# Altium project syspcb.PrjPCB
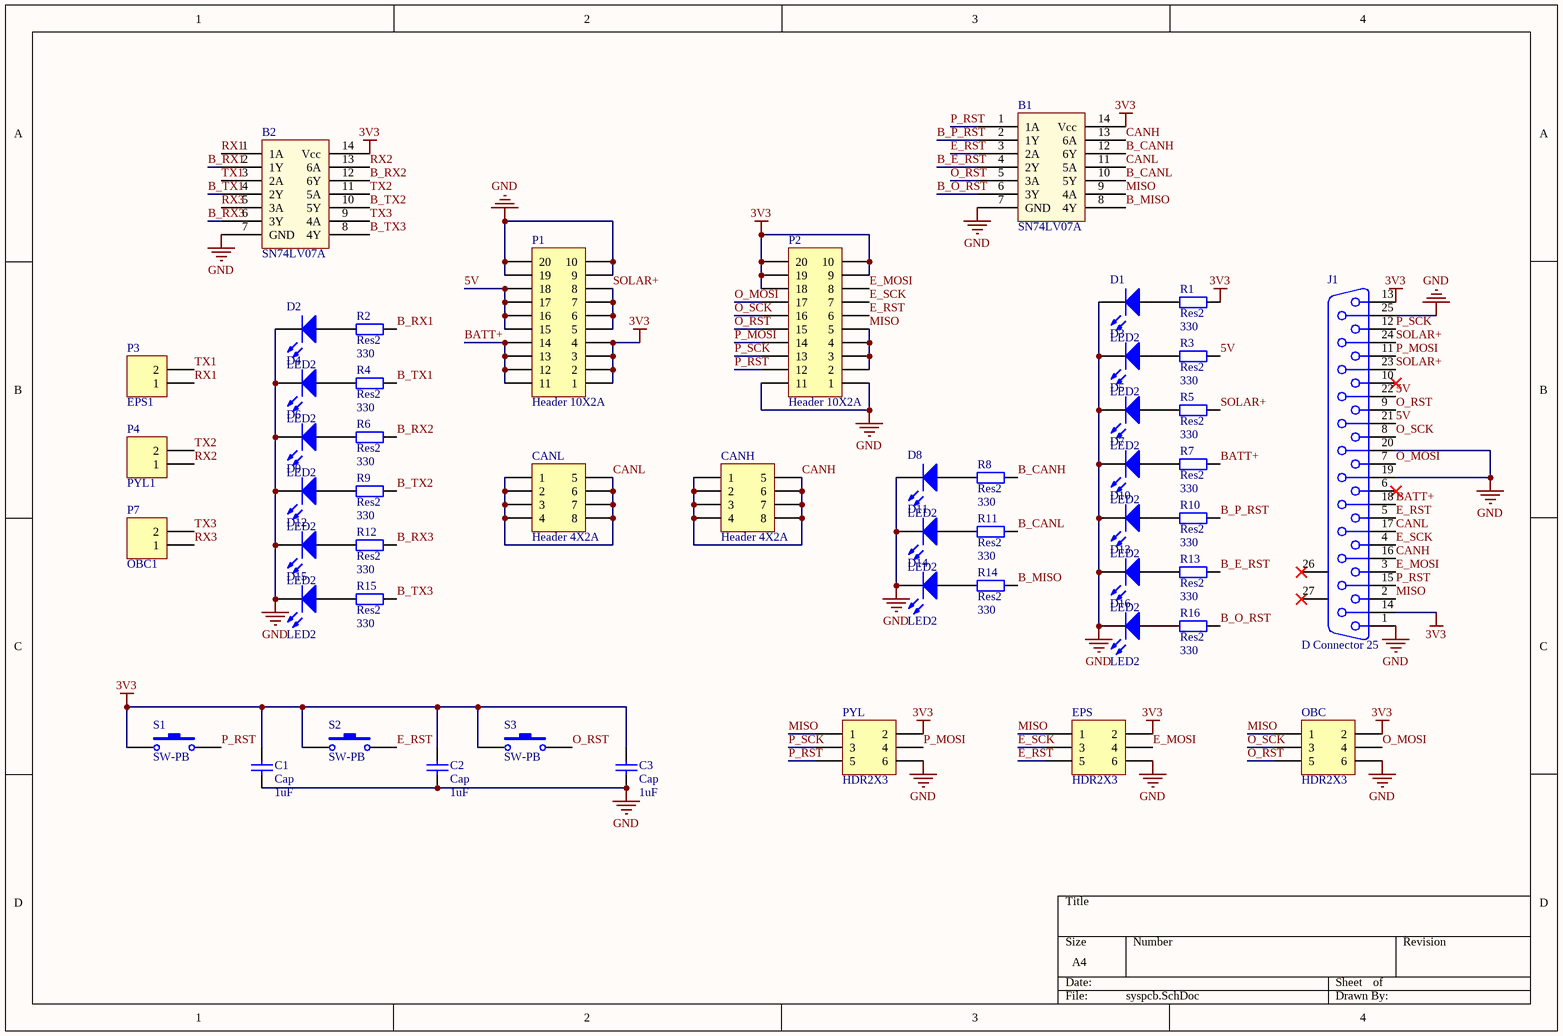
[diagram p0: syspcb.SchDoc]
1 sheet, 51 parts. Net scope: global (net labels, ports and power ports of the same name join across sheets).
Board file: syspcb.PcbDoc

## Sheet syspcb.SchDoc
size A4

### Parts
B1  SN74LV07A  [SOIC127P600X175-14N]
B2  SN74LV07A  [SOIC127P600X175-14N]
C1  Cap  value 1uF  [1608[0603]]
C2  Cap  value 1uF  [1608[0603]]
C3  Cap  value 1uF  [1608[0603]]
CANH  Header 4X2A  [HDR2X4_CEN]
CANL  Header 4X2A  [HDR2X4_CEN]
D1  LED2  [0603-LED]
D2  LED2  [0603-LED]
D3  LED2  [0603-LED]
D4  LED2  [0603-LED]
D5  LED2  [0603-LED]
D6  LED2  [0603-LED]
D7  LED2  [0603-LED]
D8  LED2  [0603-LED]
D9  LED2  [0603-LED]
D10  LED2  [0603-LED]
D11  LED2  [0603-LED]
D12  LED2  [0603-LED]
D13  LED2  [0603-LED]
D14  LED2  [0603-LED]
D15  LED2  [0603-LED]
D16  LED2  [0603-LED]
EPS  HDR2X3  [HDR2X3]
J1  D Connector 25  [DSUB1.385-2H25A]
OBC  HDR2X3  [HDR2X3]
P1  Header 10X2A  [HDR2X10_CEN]
P2  Header 10X2A  [HDR2X10_CEN]
P3  EPS1  [HDR1X2]
P4  PYL1  [HDR1X2]
P7  OBC1  [HDR1X2]
PYL  HDR2X3  [HDR2X3]
R1  Res2  value 330  [J1-0603]
R2  Res2  value 330  [J1-0603]
R3  Res2  value 330  [J1-0603]
R4  Res2  value 330  [J1-0603]
R5  Res2  value 330  [J1-0603]
R6  Res2  value 330  [J1-0603]
R7  Res2  value 330  [J1-0603]
R8  Res2  value 330  [J1-0603]
R9  Res2  value 330  [J1-0603]
R10  Res2  value 330  [J1-0603]
R11  Res2  value 330  [J1-0603]
R12  Res2  value 330  [J1-0603]
R13  Res2  value 330  [J1-0603]
R14  Res2  value 330  [J1-0603]
R15  Res2  value 330  [J1-0603]
R16  Res2  value 330  [J1-0603]
S1  SW-PB  [SW_5-1437565-0]
S2  SW-PB  [SW_5-1437565-0]
S3  SW-PB  [SW_5-1437565-0]

### Nets
3V3: B1.14(Vcc) B2.14(Vcc) C1.2 C2.2 C3.2 EPS.2 J1.13 J1.14 OBC.2 P1.1 P1.2 P1.3 P1.4 P2.9 P2.10 P2.18 P2.19 P2.20 PYL.2 R1.1 S1.1 S2.1 S3.1
GND: B1.7(GND) B2.7(GND) C1.1 C2.1 C3.1 D1.2(K) D2.2(K) D3.2(K) D4.2(K) D5.2(K) D6.2(K) D7.2(K) D8.2(K) D9.2(K) D10.2(K) D11.2(K) D12.2(K) D13.2(K) D14.2(K) D15.2(K) D16.2(K) EPS.6 J1.1 J1.19 J1.20 J1.25 OBC.6 P1.9 P1.10 P1.19 P1.20 P2.1 P2.11 PYL.6
5V: J1.21 J1.22 P1.15 P1.16 P1.17 P1.18 R3.1
B_CANH: B1.12(6Y) R8.1
B_CANL: B1.10(5Y) R11.1
B_E_RST: B1.4(2Y) R13.1
B_MISO: B1.8(4Y) R14.1
B_O_RST: B1.6(3Y) R16.1
B_P_RST: B1.2(1Y) R10.1
B_RX1: B2.2(1Y) R2.1
B_RX2: B2.12(6Y) R6.1
B_RX3: B2.6(3Y) R12.1
B_TX1: B2.4(2Y) R4.1
B_TX2: B2.10(5Y) R9.1
B_TX3: B2.8(4Y) R15.1
BATT+: J1.18 P1.11 P1.12 P1.13 P1.14 R7.1
CANH: B1.13(6A) CANH.1 CANH.2 CANH.3 CANH.4 CANH.5 CANH.6 CANH.7 CANH.8 J1.16
CANL: B1.11(5A) CANL.1 CANL.2 CANL.3 CANL.4 CANL.5 CANL.6 CANL.7 CANL.8 J1.17
E_MOSI: EPS.4 J1.3 P2.8
E_RST: B1.3(2A) EPS.5 J1.5 P2.6 S2.2
E_SCK: EPS.3 J1.4 P2.7
MISO: B1.9(4A) EPS.1 J1.2 OBC.1 P2.2 P2.3 P2.4 P2.5 PYL.1
O_MOSI: J1.7 OBC.4 P2.17
O_RST: B1.5(3A) J1.9 OBC.5 P2.15 S3.2
O_SCK: J1.8 OBC.3 P2.16
P_MOSI: J1.11 P2.14 PYL.4
P_RST: B1.1(1A) J1.15 P2.12 PYL.5 S1.2
P_SCK: J1.12 P2.13 PYL.3
RX1: B2.1(1A) P3.1
RX2: B2.13(6A) P4.1
RX3: B2.5(3A) P7.1
SOLAR+: J1.23 J1.24 P1.5 P1.6 P1.7 P1.8 R5.1
TX1: B2.3(2A) P3.2
TX2: B2.11(5A) P4.2
TX3: B2.9(4A) P7.2
NetD1_1: D1.1(A) R1.2
NetD2_1: D2.1(A) R2.2
NetD3_1: D3.1(A) R3.2
NetD4_1: D4.1(A) R4.2
NetD5_1: D5.1(A) R5.2
NetD6_1: D6.1(A) R6.2
NetD7_1: D7.1(A) R7.2
NetD8_1: D8.1(A) R8.2
NetD9_1: D9.1(A) R9.2
NetD10_1: D10.1(A) R10.2
NetD11_1: D11.1(A) R11.2
NetD12_1: D12.1(A) R12.2
NetD13_1: D13.1(A) R13.2
NetD14_1: D14.1(A) R14.2
NetD15_1: D15.1(A) R15.2
NetD16_1: D16.1(A) R16.2

Not connected (* = marked no-connect by the designer): J1 6* 10* 26(MH1)* 27(MH2)*

### Library data of the parts
C1-C3 = Cap: Capacitor; Published: 8-Jun-2000; LatestRevisionDate: 17-Jul-2002; LatestRevisionNote: Re-released for DXP Platform.; PackageReference: RAD-0.3; Publisher: Altium Limited; PackageDescription: Radial Cap, Thru-Hole; 2 Leads; 0.3 in Pin Spacing
CANH CANL = Header 4X2A: Header, 4-Pin, Dual row; LatestRevisionDate: 17-Jul-2002; LatestRevisionNote: Re-released for DXP Platform.; Publisher: Altium Limited
D1-D16 = LED2: Typical RED, GREEN, YELLOW, AMBER GaAs LED; Published: 8-Jun-2000; LatestRevisionDate: 17-Jul-2002; LatestRevisionNote: Re-released for DXP Platform.; PackageVersion: Feb-2002; PackageReference: 3.2X1.6X1.1; Publisher: Altium Limited; PackageDescription: SM LED; 2 Flat Leads
EPS OBC PYL = MHDR2X3: Header, 3-Pin, Dual row; LatestRevisionDate: 17-Jul-2002; LatestRevisionNote: Re-released for DXP Platform.; Publisher: Altium Limited
J1 = D Connector 25: Receptacle Assembly, 25 Position, Right Angle; PackageDocument: U; Positions: 25; Published: 15-Jun-2001; LatestRevisionDate: 17-Jul-2002; LatestRevisionNote: Re-released for DXP Platform.; DatasheetDocument: 19-Mar-1999; PackageReference: 787202; Publisher: Altium Limited; Orientation: Right Angle; Gender: Receptacle
P1 P2 = Header 10X2A: Header, 10-Pin, Dual row; LatestRevisionDate: 17-Jul-2002; LatestRevisionNote: Re-released for DXP Platform.; Publisher: Altium Limited
P3 P4 P7 = Header 2: Header, 2-Pin; LatestRevisionDate: 17-Jul-2002; LatestRevisionNote: Re-released for DXP Platform.; Publisher: Altium Limited
R1-R16 = Res2: Resistor; Published: 8-Jun-2000; LatestRevisionDate: 17-Jul-2002; LatestRevisionNote: Re-released for DXP Platform.; PackageReference: AXIAL-0.4; Publisher: Altium Limited; PackageDescription: Axial Device, Thru-Hole; 2 Leads; 0.4 in Pin Spacing
S1-S3 = SW-PB: Switch; Published: 24-Mar-1999; LatestRevisionDate: 17-Jul-2002; LatestRevisionNote: Re-released for DXP Platform.; PackageReference: SPST-2; Publisher: Altium Limited; PackageDescription: Switch; 2 Leads